# EAGLE design Edison_Mezzanine_ArduinoPro (EAGLE 7.1.0)

## Sheet 1 of 2
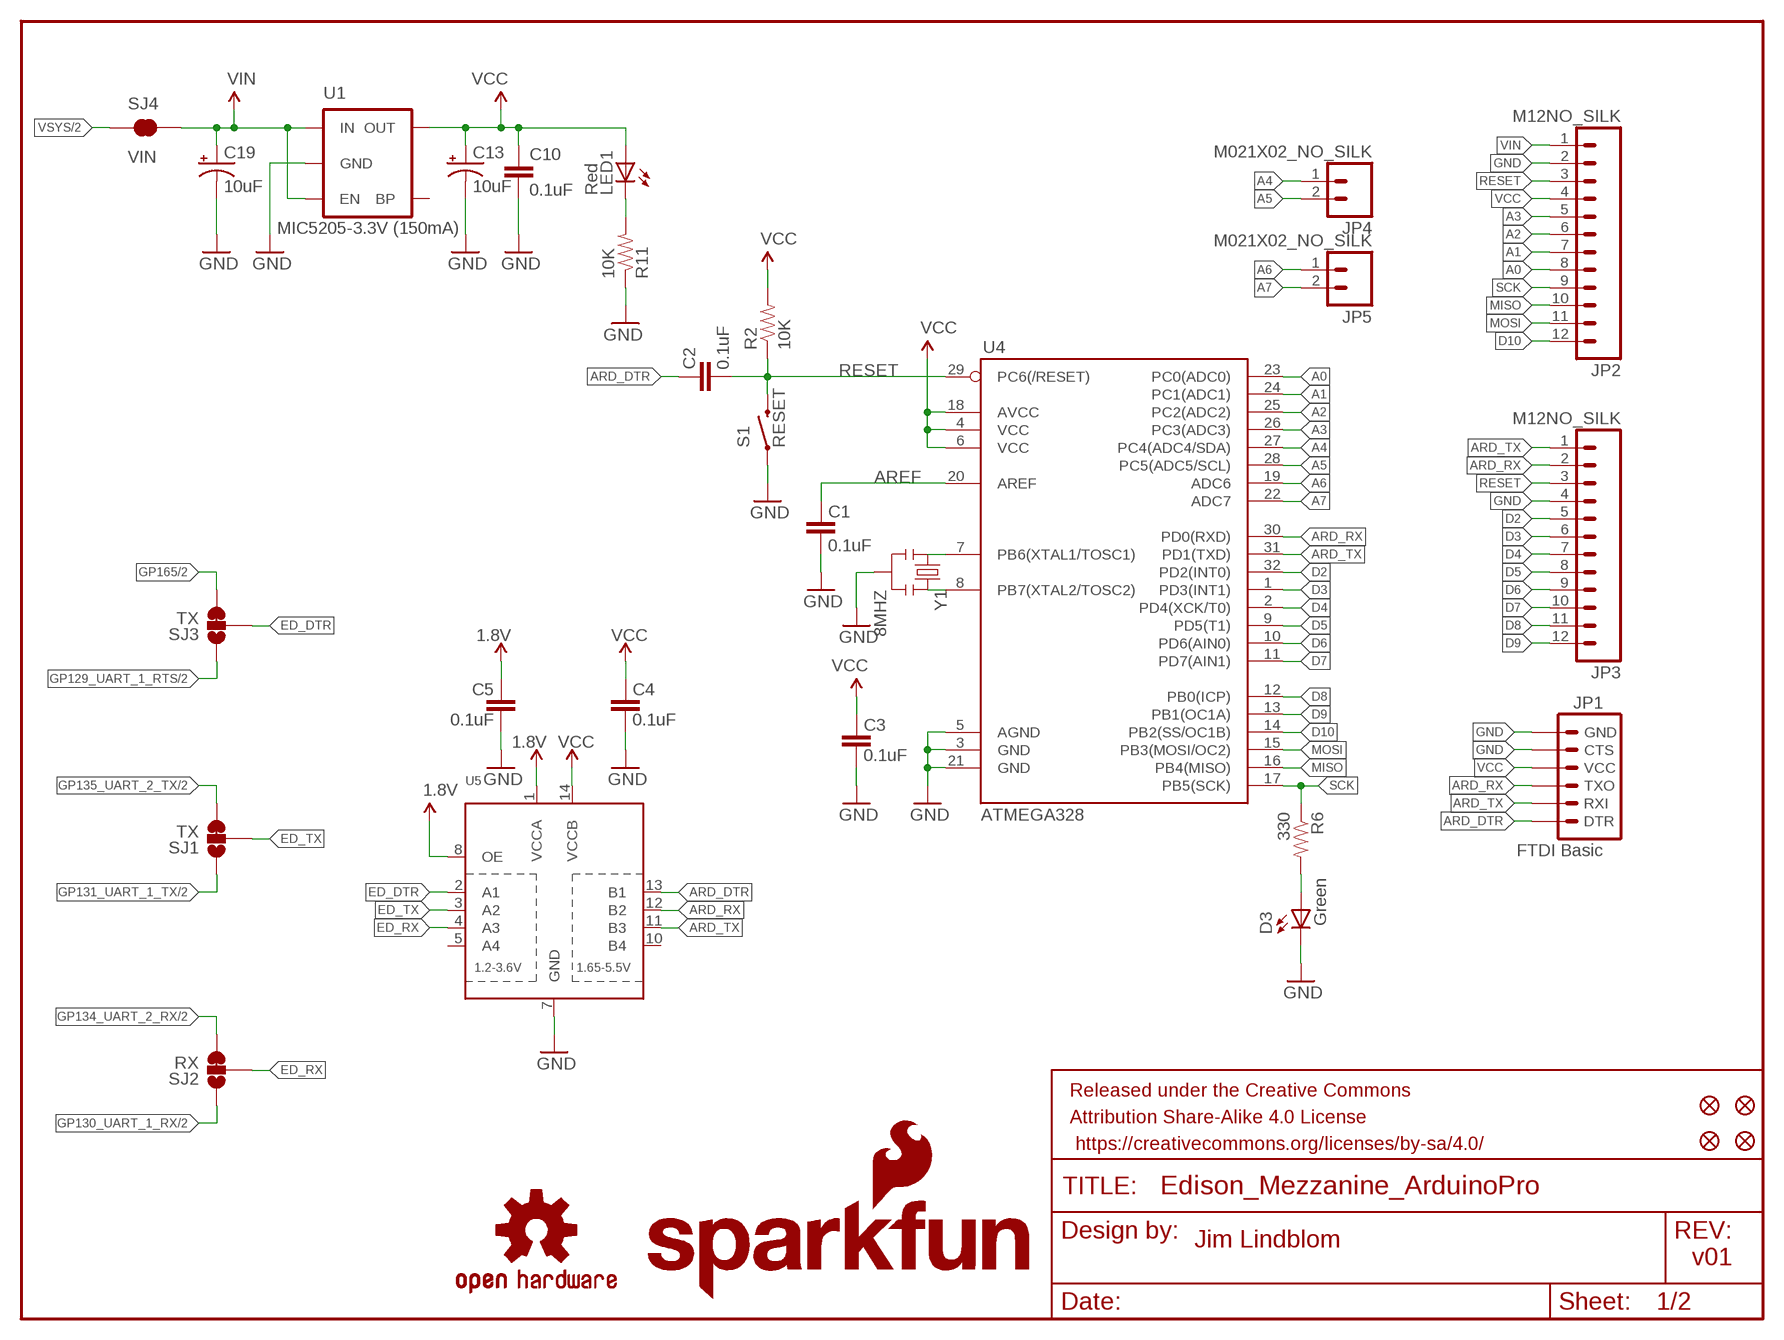
[diagram p0: schematic, sheet 1]

### Parts
C1  0.1uF  CAP0603-CAP  [0603-CAP]
C2  0.1uF  CAP0603-CAP  [0603-CAP]
C3  0.1uF  CAP0603-CAP  [0603-CAP]
C4  0.1uF  CAP0603-CAP  [0603-CAP]
C5  0.1uF  CAP0603-CAP  [0603-CAP]
C10  0.1uF  CAP0603-CAP  [0603-CAP]
C13  10uF  CAP_POL1206  [EIA3216]
C19  10uF  CAP_POL1206  [EIA3216]
D3  Green  LED  [0603-LED-ALT1]
FID1  FIDUCIAL1X2  [FIDUCIAL-1X2]
FID2  FIDUCIAL1X2  [FIDUCIAL-1X2]
FID3  FIDUCIAL1X2  [FIDUCIAL-1X2]
FID4  FIDUCIAL1X2  [FIDUCIAL-1X2]
FRAME1  FRAME-LETTER  [CREATIVE_COMMONS]
JP1  FTDI Basic  ARDUINO_SERIAL_PROGRAMPTH  [1X06]
JP2  M12NO_SILK  [1X12_NO_SILK]
JP3  M12NO_SILK  [1X12_NO_SILK]
JP4  M021X02_NO_SILK  [1X02_NO_SILK]
JP5  M021X02_NO_SILK  [1X02_NO_SILK]
LED1  Red  LED  [0603-LED-ALT1]
LOGO1  OSHW-LOGOS  [OSHW-LOGO-S]
LOGO4  SFE_LOGO_NAME_FLAME.1_INCH  [SFE_LOGO_NAME_FLAME_.1]
R2  10K  RESISTOR0603-RES  [0603-RES]
R6  330  RESISTOR0603-RES  [0603-RES]
R11  10K  RESISTOR0603-RES  [0603-RES]
S1  RESET  SWITCH-MOMENTARY-2-SMD-1101NE  [TACTILE-SWITCH-1101NE]
SJ1  TX  JUMPER-PAD-3-2OF3_NC_BY_TRACE  [PAD-JUMPER-3-2OF3_NC_BY_TRACE_YES_SILK_FULL_BOX]
SJ2  RX  JUMPER-PAD-3-2OF3_NC_BY_TRACE  [PAD-JUMPER-3-2OF3_NC_BY_TRACE_YES_SILK_FULL_BOX]
SJ3  TX  JUMPER-PAD-3-2OF3_NC_BY_TRACE  [PAD-JUMPER-3-2OF3_NC_BY_TRACE_YES_SILK_FULL_BOX]
SJ4  VIN  JUMPER-PAD-2-NC_BY_TRACE  [PAD-JUMPER-2-NC_BY_TRACE_YES_SILK]
U1  MIC5205-3.3V (150mA)  V_REG_LDOSMD  [SOT23-5]
U4  ATMEGA328  ATMEGA168  [TQFP32-08]
U5  TXB0104PWRSOIC14  [SO14]
Y1  8MHZ  RESONATOR8MHZ  [RESONATOR-SMD]

### Nets
1.8V: C5.2 U5.1(VCCA) U5.8(OE) ; also sheet 2
A0: JP2.8 U4.23(PC0(ADC0))
A1: JP2.7 U4.24(PC1(ADC1))
A2: JP2.6 U4.25(PC2(ADC2))
A3: JP2.5 U4.26(PC3(ADC3))
A4: JP4.1 U4.27(PC4(ADC4/SDA))
A5: JP4.2 U4.28(PC5(ADC5/SCL))
A6: JP5.1 U4.19(ADC6)
A7: JP5.2 U4.22(ADC7)
ARD_DTR: C2.2 JP1.1(DTR) U5.13(B1)
ARD_RX: JP1.3(TXO) JP3.2 U4.30(PD0(RXD)) U5.12(B2)
ARD_TX: JP1.2(RXI) JP3.1 U4.31(PD1(TXD)) U5.11(B3)
AREF: C1.2 U4.20(AREF)
D2: JP3.5 U4.32(PD2(INT0))
D3: JP3.6 U4.1(PD3(INT1))
D4: JP3.7 U4.2(PD4(XCK/T0))
D5: JP3.8 U4.9(PD5(T1))
D6: JP3.9 U4.10(PD6(AIN0))
D7: JP3.10 U4.11(PD7(AIN1))
D8: JP3.11 U4.12(PB0(ICP))
D9: JP3.12 U4.13(PB1(OC1A))
D10: JP2.12 U4.14(PB2(SS/OC1B))
ED_DTR: SJ3.2 U5.2(A1)
ED_RX: SJ2.2 U5.4(A3)
ED_TX: SJ1.2 U5.3(A2)
GND: C1.1 C3.1 C4.1 C5.1 C10.2 C13.C(-) C19.C(-) D3.C JP1.5(CTS) JP1.6(GND) JP2.2 JP3.4 R11.1 S1.P$1 U1.2(GND) U4.3(GND) U4.5(AGND) U4.21(GND) U5.7(GND) Y1.2 ; also sheet 2
GP129_UART_1_RTS: SJ3.1 ; also sheet 2
GP130_UART_1_RX: SJ2.1 ; also sheet 2
GP131_UART_1_TX: SJ1.1 ; also sheet 2
GP134_UART_2_RX: SJ2.3 ; also sheet 2
GP135_UART_2_TX: SJ1.3 ; also sheet 2
GP165: SJ3.3 ; also sheet 2
MISO: JP2.10 U4.16(PB4(MISO))
MOSI: JP2.11 U4.15(PB3(MOSI/OC2))
N$1: U4.8(PB7(XTAL2/TOSC2)) Y1.3
N$2: U4.7(PB6(XTAL1/TOSC1)) Y1.1
N$4: LED1.C R11.2
N$7: D3.A R6.2
RESET: C2.1 JP2.3 JP3.3 R2.1 S1.P$2 U4.29(PC6(/RESET))
SCK: JP2.9 R6.1 U4.17(PB5(SCK))
VCC: C3.2 C4.2 C10.1 C13.A(+) JP1.4(VCC) JP2.4 LED1.A R2.2 U1.5(OUT) U4.4(VCC) U4.6(VCC) U4.18(AVCC) U5.14(VCCB)
VIN: C19.A(+) JP2.1 SJ4.2 U1.1(IN) U1.3(EN)
VSYS: SJ4.1 ; also sheet 2
Unconnected: U1.4(BP) U5.5(A4) U5.10(B4)

### Notes on the sheet
- Jim Lindblom
- v01

## Sheet 2 of 2
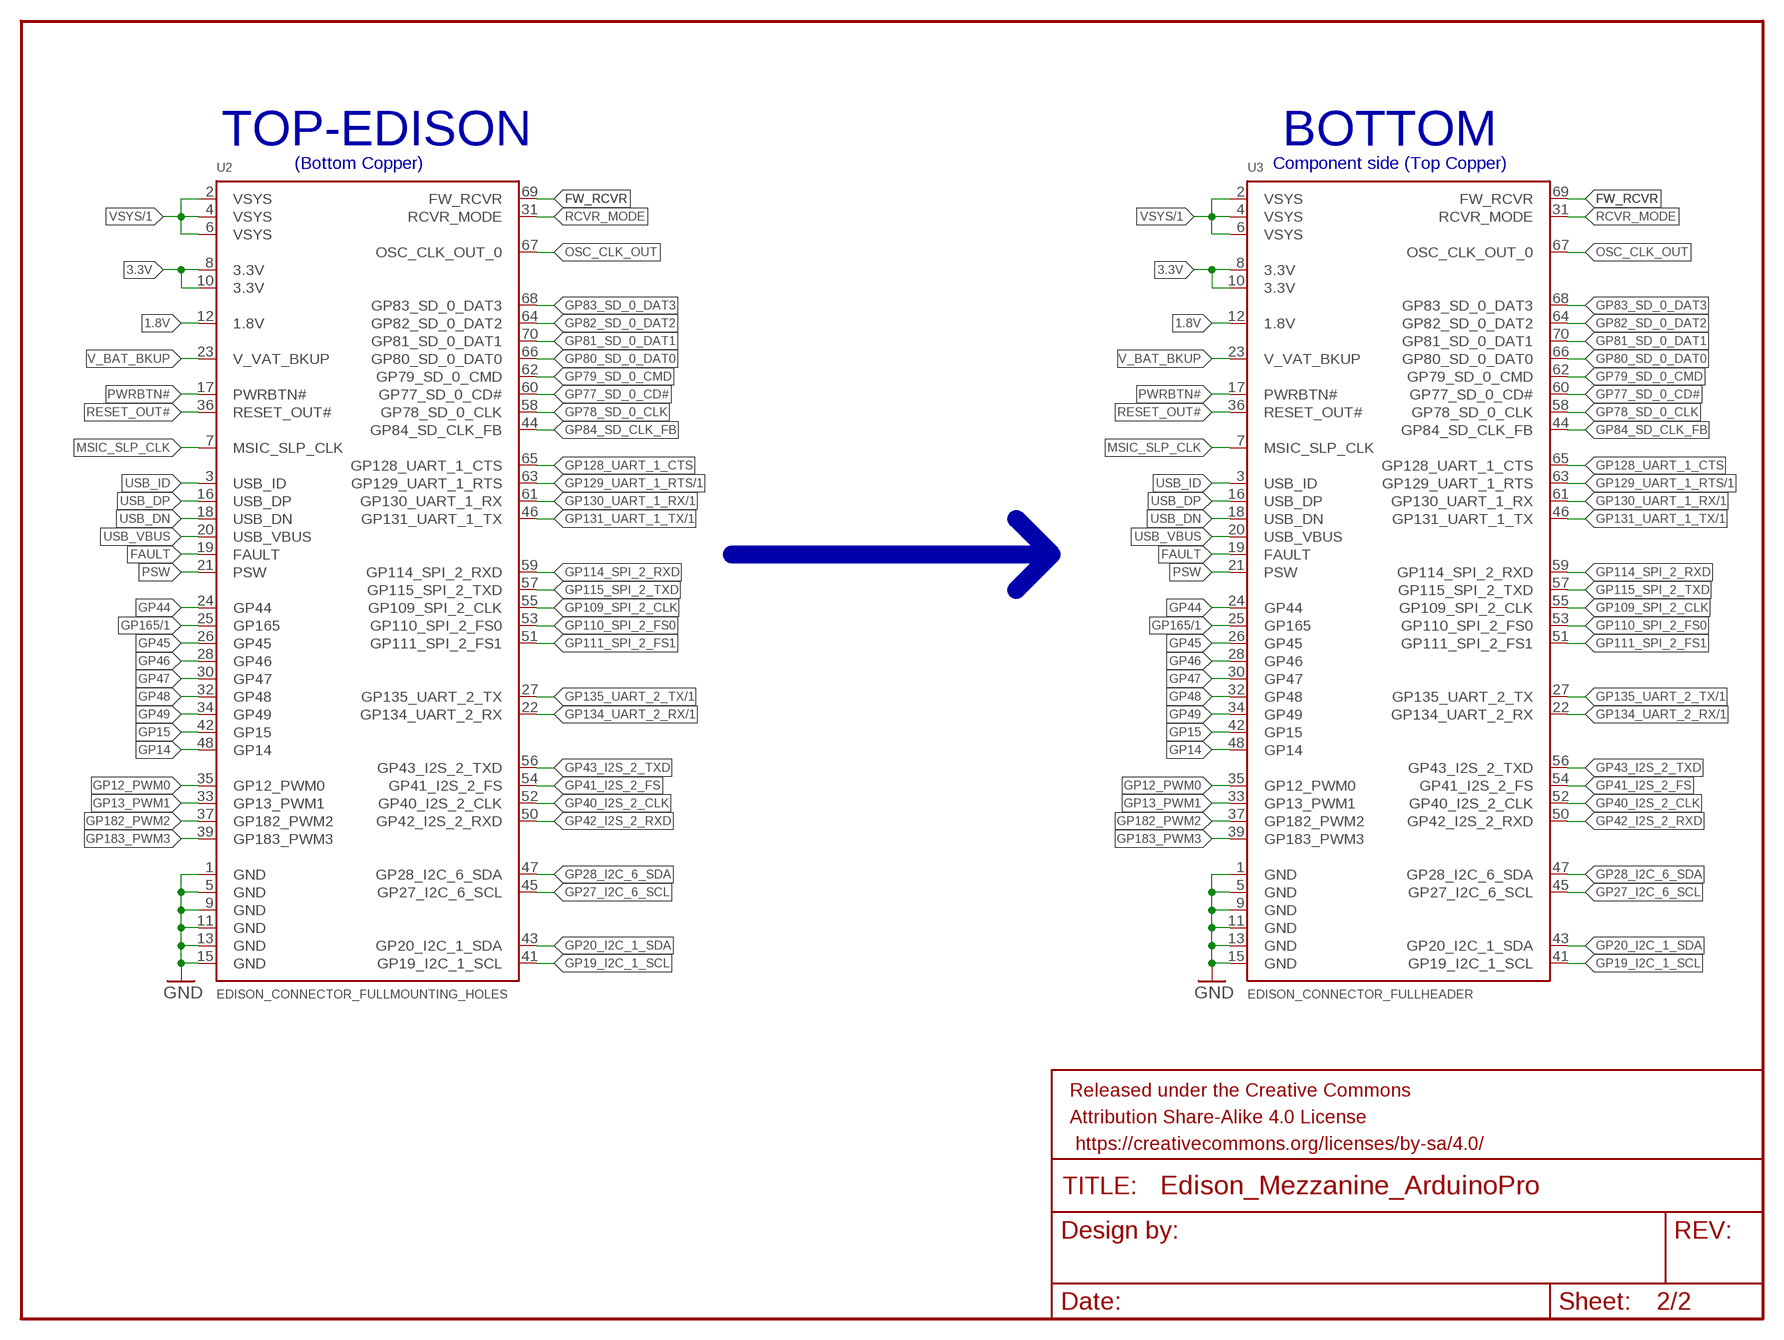
[diagram p1: schematic, sheet 2]

### Parts
FRAME2  FRAME-LETTER  [CREATIVE_COMMONS]
U2  EDISON_CONNECTOR_FULLMOUNTING_HOLES  [EDISON_DAUGHTER]
U3  EDISON_CONNECTOR_FULLHEADER  [DF40C-70DP-0.4(51)]

### Nets
1.8V: U2.12(1.8V) U3.12(1.8V) ; also sheet 1
3.3V: U2.8(3.3V) U2.10(3.3V) U3.8(3.3V) U3.10(3.3V)
FAULT: U2.19(FAULT) U3.19(FAULT)
FW_RCVR: U2.69(FW_RCVR) U3.69(FW_RCVR)
GND: U2.1(GND) U2.5(GND) U2.9(GND) U2.11(GND) U2.13(GND) U2.15(GND) U3.1(GND) U3.5(GND) U3.9(GND) U3.11(GND) U3.13(GND) U3.15(GND) ; also sheet 1
GP12_PWM0: U2.35(GP12_PWM0) U3.35(GP12_PWM0)
GP13_PWM1: U2.33(GP13_PWM1) U3.33(GP13_PWM1)
GP14: U2.48(GP14) U3.48(GP14)
GP15: U2.42(GP15) U3.42(GP15)
GP19_I2C_1_SCL: U2.41(GP19_I2C_1_SCL) U3.41(GP19_I2C_1_SCL)
GP20_I2C_1_SDA: U2.43(GP20_I2C_1_SDA) U3.43(GP20_I2C_1_SDA)
GP27_I2C_6_SCL: U2.45(GP27_I2C_6_SCL) U3.45(GP27_I2C_6_SCL)
GP28_I2C_6_SDA: U2.47(GP28_I2C_6_SDA) U3.47(GP28_I2C_6_SDA)
GP40_I2S_2_CLK: U2.52(GP40_I2S_2_CLK) U3.52(GP40_I2S_2_CLK)
GP41_I2S_2_FS: U2.54(GP41_I2S_2_FS) U3.54(GP41_I2S_2_FS)
GP42_I2S_2_RXD: U2.50(GP42_I2S_2_RXD) U3.50(GP42_I2S_2_RXD)
GP43_I2S_2_TXD: U2.56(GP43_I2S_2_TXD) U3.56(GP43_I2S_2_TXD)
GP44: U2.24(GP44) U3.24(GP44)
GP45: U2.26(GP45) U3.26(GP45)
GP46: U2.28(GP46) U3.28(GP46)
GP47: U2.30(GP47) U3.30(GP47)
GP48: U2.32(GP48) U3.32(GP48)
GP49: U2.34(GP49) U3.34(GP49)
GP77_SD_0_CD#: U2.60(GP77_SD_0_CD#) U3.60(GP77_SD_0_CD#)
GP78_SD_0_CLK: U2.58(GP78_SD_0_CLK) U3.58(GP78_SD_0_CLK)
GP79_SD_0_CMD: U2.62(GP79_SD_0_CMD) U3.62(GP79_SD_0_CMD)
GP80_SD_0_DAT0: U2.66(GP80_SD_0_DAT0) U3.66(GP80_SD_0_DAT0)
GP81_SD_0_DAT1: U2.70(GP81_SD_0_DAT1) U3.70(GP81_SD_0_DAT1)
GP82_SD_0_DAT2: U2.64(GP82_SD_0_DAT2) U3.64(GP82_SD_0_DAT2)
GP83_SD_0_DAT3: U2.68(GP83_SD_0_DAT3) U3.68(GP83_SD_0_DAT3)
GP84_SD_CLK_FB: U2.44(GP84_SD_CLK_FB) U3.44(GP84_SD_CLK_FB)
GP109_SPI_2_CLK: U2.55(GP109_SPI_2_CLK) U3.55(GP109_SPI_2_CLK)
GP110_SPI_2_FS0: U2.53(GP110_SPI_2_FS0) U3.53(GP110_SPI_2_FS0)
GP111_SPI_2_FS1: U2.51(GP111_SPI_2_FS1) U3.51(GP111_SPI_2_FS1)
GP114_SPI_2_RXD: U2.59(GP114_SPI_2_RXD) U3.59(GP114_SPI_2_RXD)
GP115_SPI_2_TXD: U2.57(GP115_SPI_2_TXD) U3.57(GP115_SPI_2_TXD)
GP128_UART_1_CTS: U2.65(GP128_UART_1_CTS) U3.65(GP128_UART_1_CTS)
GP129_UART_1_RTS: U2.63(GP129_UART_1_RTS) U3.63(GP129_UART_1_RTS) ; also sheet 1
GP130_UART_1_RX: U2.61(GP130_UART_1_RX) U3.61(GP130_UART_1_RX) ; also sheet 1
GP131_UART_1_TX: U2.46(GP131_UART_1_TX) U3.46(GP131_UART_1_TX) ; also sheet 1
GP134_UART_2_RX: U2.22(GP134_UART_2_RX) U3.22(GP134_UART_2_RX) ; also sheet 1
GP135_UART_2_TX: U2.27(GP135_UART_2_TX) U3.27(GP135_UART_2_TX) ; also sheet 1
GP165: U2.25(GP165) U3.25(GP165) ; also sheet 1
GP182_PWM2: U2.37(GP182_PWM2) U3.37(GP182_PWM2)
GP183_PWM3: U2.39(GP183_PWM3) U3.39(GP183_PWM3)
MSIC_SLP_CLK: U2.7(MSIC_SLP_CLK) U3.7(MSIC_SLP_CLK)
OSC_CLK_OUT: U2.67(OSC_CLK_OUT_0) U3.67(OSC_CLK_OUT_0)
PSW: U2.21(PSW) U3.21(PSW)
PWRBTN#: U2.17(PWRBTN#) U3.17(PWRBTN#)
RCVR_MODE: U2.31(RCVR_MODE) U3.31(RCVR_MODE)
RESET_OUT#: U2.36(RESET_OUT#) U3.36(RESET_OUT#)
USB_DN: U2.18(USB_DN) U3.18(USB_DN)
USB_DP: U2.16(USB_DP) U3.16(USB_DP)
USB_ID: U2.3(USB_ID) U3.3(USB_ID)
USB_VBUS: U2.20(USB_VBUS) U3.20(USB_VBUS)
V_BAT_BKUP: U2.23(V_VAT_BKUP) U3.23(V_VAT_BKUP)
VSYS: U2.2(VSYS) U2.4(VSYS) U2.6(VSYS) U3.2(VSYS) U3.4(VSYS) U3.6(VSYS) ; also sheet 1

### Buses
B$1

### Notes on the sheet
- TOP-EDISON | BOTTOM
- (Bottom Copper) | Component side (Top Copper)

## Library data of the parts
C1-C5 C10 = SparkFun:CAP: Capacitor Standard 0603 ceramic capacitor, and 0.1" leaded capacitor.
C13 C19 = SparkFun:CAP_POL: Capacitor Polarized These are standard SMD and PTH capacitors. Normally 10uF, 47uF, and 100uF in electrolytic and tantalum varieties. Always verify the external diameter of the through hole cap, it varies with capacity, voltage, and manufacturer. The EIA devices should be standard.
D3 LED1 = Testing:LED: LEDs Standard schematic elements and footprints for 5mm, 3mm, 1206, and 0603 sized LEDs. 5mm - Spark Fun Electronics SKU : COM-00529 (and others)
FID1-FID4 = SparkFun-Aesthetics:FIDUCIAL: Fiducial Alignment Points Various fiducial points for machine vision alignment.
FRAME1 FRAME2 = SparkFun-Aesthetics:FRAME-LETTER: Schematic Frame Standard 8.5x11 US Letter frame
JP1 = SparkFun:ARDUINO_SERIAL_PROGRAM
JP2 JP3 = SparkFun-Connectors:M12: Header 12 Standard 12-pin 0.1" header. Use with straight break away headers (SKU : PRT-00116), right angle break away headers (PRT-00553), swiss pins (PRT-00743), machine pins (PRT-00117), and female headers (PRT-00115).
JP4 JP5 = SparkFun-Connectors:M02: Standard 2-pin 0.1" header. Use with - straight break away headers ( PRT-00116) - right angle break away headers (PRT-00553) - swiss pins (PRT-00743) - machine pins (PRT-00117) - female headers (PRT-00115) Molex polarized connector foot print use with: PRT-08233 with associated crimp pins and housings. 2.54_SCREWTERM for use with PRT-10571. 3.5mm Screw Terminal footprints for PRT-08084 5mm Screw Terminal footprints for use with PRT-08432
LOGO1 = SparkFun-Aesthetics:OSHW-LOGO: Open Source Hardware Logo This logo indicates the piece of hardware it is found on incorporates a OSHW license and/or adheres to the definition of open source hardware found here: http://freedomdefined.org/OSHW
LOGO4 = SparkFun-Aesthetics:SFE_LOGO_NAME_FLAME: SFE Logo, name and flame This is the SparkFun full logo. The logo on the schematic will always be the same size; the package variant is the height of the flame part of the logo. Default layer for the logo on the board is tSilk.
R2 R6 R11 = SparkFun:RESISTOR: Resistor Basic schematic elements and footprints for 0603, 1206, and PTH resistors.
S1 = SparkFun-Electromechanical:SWITCH-MOMENTARY-2: Various NO switches- pushbuttons, reed, etc
SJ1-SJ3 = SparkFun-Passives:JUMPER-PAD-3-2OF3_NC_BY_TRACE
SJ4 = SparkFun-Passives:JUMPER-PAD-2-NC_BY_TRACE
U1 = SparkFun:V_REG_LDO: Voltage Regulator LDO Standard 150mA LDO voltage regulator in SOT-23 layout. Micrel part MIC5205. BP (by-pass) pin is used to lower output noise with 470pF cap.
U2 U3 = Edison:EDISON_CONNECTOR_FULL
U4 = SparkFun:ATMEGA168
U5 = SparkFun-DigitalIC:TXB0104PWR: 4-Bit Bi-Directional Level Shifter 1.2V-3.6V (VCCA) to 1.65V-5.5V (VCCB) bi-directional level shifter with auto direction sensing. Max data rate - VCCA 1.8V: 20Mbps (50ns), VCCA 3.3V: 100Mbps (10ns) Digikey: 296-21929-1-ND (TSSOP) IC-11329; PROD_ID: IC-11329
Y1 = SparkFun-FreqCtrl:RESONATOR: Resonator Small SMD resonator. Used, eg, on the Arduino Pro/ Pro Mini boards. 8MHz- XTAL-08895 16MHz- XTAL-08900; PROD_ID: XTAL-08895

## Net classes
1 vcc: width 0.254 mm

## Board
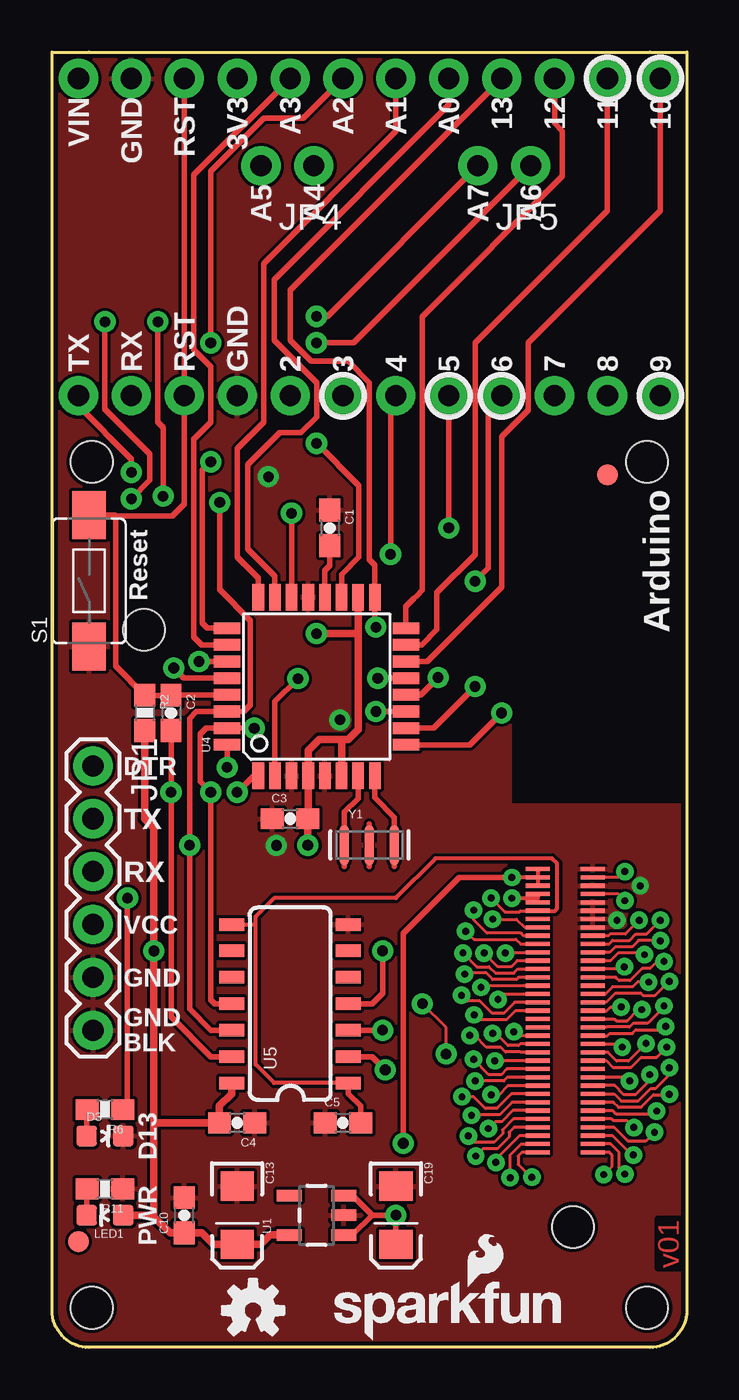
[diagram p2: board, top side]
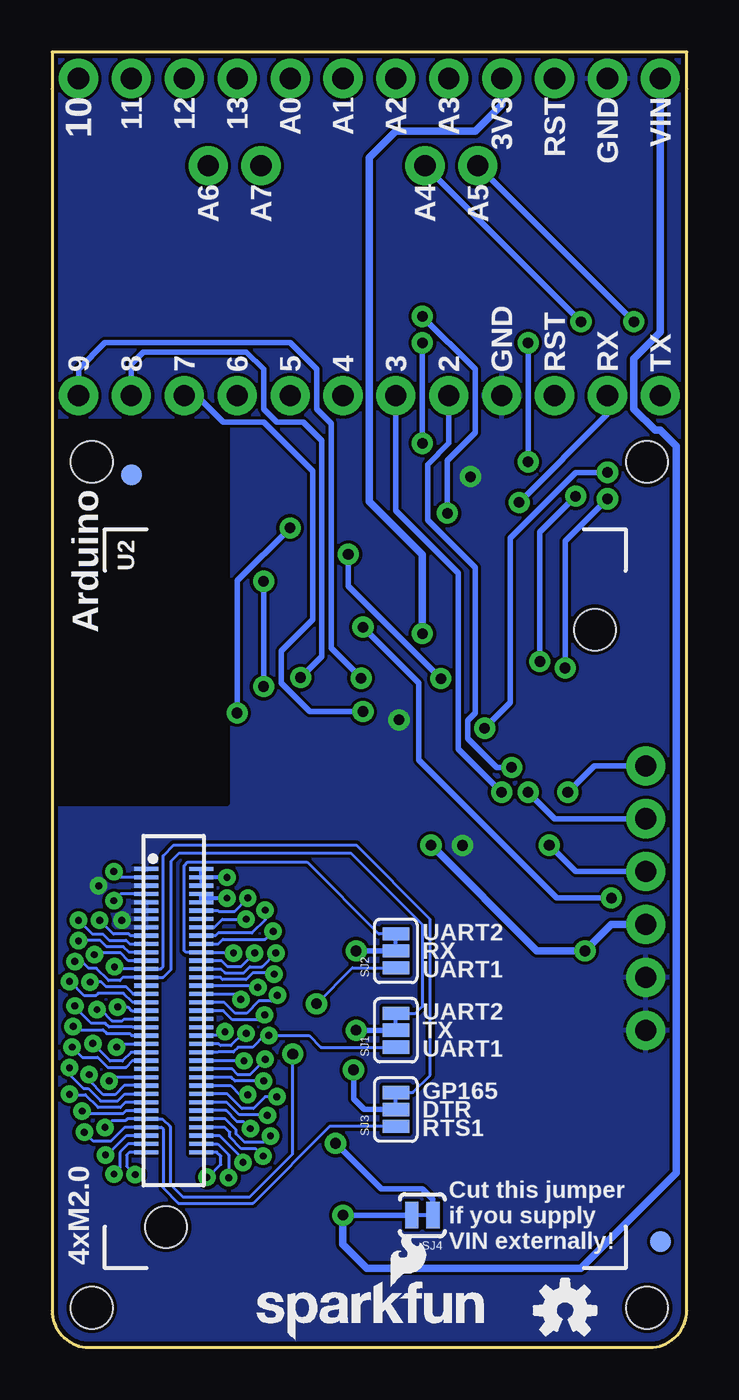
[diagram p3: board, bottom side, seen from below]

Size 30.48 x 62.23 mm. Coordinates in mm from the lower left corner, seen from the top.
Outline: 30.48,60.45 30.48,1.78 arc-90 28.7,0 1.78,0 arc-90 0,1.78 0,60.45 0,62.23 1.78,62.23 28.7,62.23 30.48,62.23 30.48,60.45
Copper layers (1*16): Top 0.035mm / dielectric 1.5mm / Bottom 0.035mm
Design rules "SparkFun-2-layer *": minimum track width 6mil, minimum drill 13mil, track to track 6mil, track to pad 6mil, pad to pad 6mil, via to via 6mil, smd to smd 6mil, copper to edge 8mil, drill to drill 8mil, minimum pad ring 12mil, minimum via ring 10mil, stop-mask expansion 4mil, vias tented up to drill 20mil, thermal gap 6mil
Holes 2 mm at 28.57,1.91 1.91,1.91 1.91,42.55 28.57,42.55
tRestrict: area 22.1,26.2 to 30.5,44.5
bRestrict: area 22.1,26.2 to 30.5,44.5

### Footprints (pad centres in the part's own frame; a part is rotated, then mirrored left to right if it is on the bottom)
0603-CAP = smd 1.1 x 1: 1 -0.85,0; 2 0.85,0
EIA3216 = smd 1.4 x 1.6: A 1.4,0; C -1.4,0
0603-LED-ALT1 = smd 1 x 1: A 0,-0.877; C 0,0.877
FIDUCIAL-1X2 = smd 1 x 1: 1 0,0
1X06 = drill 1.016 pad 1.88: 1 0,0; 2 2.54,0; 3 5.08,0; 4 7.62,0; 5 10.16,0; 6 12.7,0
1X12_NO_SILK = drill 1.016 pad 1.88: 1 0,0; 2 2.54,0; 3 5.08,0; 4 7.62,0; 5 10.16,0; 6 12.7,0; 7 15.24,0; 8 17.78,0; 9 20.32,0; 10 22.86,0; 11 25.4,0; 12 27.94,0
1X02_NO_SILK = drill 1.016 pad 1.88: 1 0,0; 2 2.54,0
0603-RES = smd 1.1 x 1: 1 -0.85,0; 2 0.85,0
TACTILE-SWITCH-1101NE = smd 2.3 x 1.6: P$1 -3.15,0; P$2 3.15,0
PAD-JUMPER-3-2OF3_NC_BY_TRACE_YES_SILK_FULL_BOX = smd 0.635 x 1.27: 1 -0.813,0; 2 0,0; 3 0.813,0
PAD-JUMPER-2-NC_BY_TRACE_YES_SILK = smd 0.635 x 1.27: 1 -0.508,0; 2 0.508,0
SOT23-5 = smd 0.55 x 1.2: 1 -0.95,-1.3; 2 0,-1.3; 3 0.95,-1.3; 4 0.95,1.3; 5 -0.95,1.3
EDISON_DAUGHTER = smd 1.14 x 0.2: 1 1.98,19.17; 2 4.62,19.17; 3 1.98,18.77; 4 4.62,18.77; 5 1.98,18.37; 6 4.62,18.37; 7 1.98,17.97; 8 4.62,17.97; 9 1.98,17.57; 10 4.62,17.57; 11 1.98,17.17; 12 4.62,17.17; 13 1.98,16.77; 14 4.62,16.77; 15 1.98,16.37; 16 4.62,16.37; 17 1.98,15.97; 18 4.62,15.97; 19 1.98,15.57; 20 4.62,15.57; 21 1.98,15.17; 22 4.62,15.17; 23 1.98,14.77; 24 4.62,14.77; 25 1.98,14.37; 26 4.62,14.37; 27 1.98,13.97; 28 4.62,13.97; 29 1.98,13.57; 30 4.62,13.57; 31 1.98,13.17; 32 4.62,13.17; 33 1.98,12.77; 34 4.62,12.77; 35 1.98,12.37; 36 4.62,12.37; 37 1.98,11.97; 38 4.62,11.97; 39 1.98,11.57; 40 4.62,11.57; 41 1.98,11.17; 42 4.62,11.17; 43 1.98,10.77; 44 4.62,10.77; 45 1.98,10.37; 46 4.62,10.37; 47 1.98,9.97; 48 4.62,9.97; 49 1.98,9.57; 50 4.62,9.57; 51 1.98,9.17; 52 4.62,9.17; 53 1.98,8.77; 54 4.62,8.77; 55 1.98,8.37; 56 4.62,8.37; 57 1.98,7.97; 58 4.62,7.97; 59 1.98,7.57; 60 4.62,7.57; 61 1.98,7.17; 62 4.62,7.17; 63 1.98,6.77; 64 4.62,6.77; 65 1.98,6.37; 66 4.62,6.37; 67 1.98,5.97; 68 4.62,5.97; 69 1.98,5.57; 70 4.62,5.57 | hole 2: 23.53,30.67; 2.93,1.98
DF40C-70DP-0.4(51) = smd 0.2 x 1.14 bottom: 1 6.8,1.32; 2 6.8,-1.32; 3 6.4,1.32; 4 6.4,-1.32; 5 6,1.32; 6 6,-1.32; 7 5.6,1.32; 8 5.6,-1.32; 9 5.2,1.32; 10 5.2,-1.32; 11 4.8,1.32; 12 4.8,-1.32; 13 4.4,1.32; 14 4.4,-1.32; 15 4,1.32; 16 4,-1.32; 17 3.6,1.32; 18 3.6,-1.32; 19 3.2,1.32; 20 3.2,-1.32; 21 2.8,1.32; 22 2.8,-1.32; 23 2.4,1.32; 24 2.4,-1.32; 25 2,1.32; 26 2,-1.32; 27 1.6,1.32; 28 1.6,-1.32; 29 1.2,1.32; 30 1.2,-1.32; 31 0.8,1.32; 32 0.8,-1.32; 33 0.4,1.32; 34 0.4,-1.32; 35 0,1.32; 36 0,-1.32; 37 -0.4,1.32; 38 -0.4,-1.32; 39 -0.8,1.32; 40 -0.8,-1.32; 41 -1.2,1.32; 42 -1.2,-1.32; 43 -1.6,1.32; 44 -1.6,-1.32; 45 -2,1.32; 46 -2,-1.32; 47 -2.4,1.32; 48 -2.4,-1.32; 49 -2.8,1.32; 50 -2.8,-1.32; 51 -3.2,1.32; 52 -3.2,-1.32; 53 -3.6,1.32; 54 -3.6,-1.32; 55 -4,1.32; 56 -4,-1.32; 57 -4.4,1.32; 58 -4.4,-1.32; 59 -4.8,1.32; 60 -4.8,-1.32; 61 -5.2,1.32; 62 -5.2,-1.32; 63 -5.6,1.32; 64 -5.6,-1.32; 65 -6,1.32; 66 -6,-1.32; 67 -6.4,1.32; 68 -6.4,-1.32; 69 -6.8,1.32; 70 -6.8,-1.32
TQFP32-08 = smd 1.27 x 0.559: 1 -4.293,2.8; 2 -4.293,2; 3 -4.293,1.2; 4 -4.293,0.4; 5 -4.293,-0.4; 6 -4.293,-1.2; 7 -4.293,-2; 8 -4.293,-2.8; 17 4.293,-2.8; 18 4.293,-2; 19 4.293,-1.2; 20 4.293,-0.4; 21 4.293,0.4; 22 4.293,1.2; 23 4.293,2; 24 4.293,2.8 | smd 0.559 x 1.27: 9 -2.8,-4.293; 10 -2,-4.293; 11 -1.2,-4.293; 12 -0.4,-4.293; 13 0.4,-4.293; 14 1.2,-4.293; 15 2,-4.293; 16 2.8,-4.293; 25 2.8,4.293; 26 2,4.293; 27 1.2,4.293; 28 0.4,4.293; 29 -0.4,4.293; 30 -1.2,4.293; 31 -2,4.293; 32 -2.8,4.293
SO14 = smd 0.6 x 1.2: 1 -3.81,-2.8; 2 -2.54,-2.8; 3 -1.27,-2.8; 4 0,-2.8; 5 1.27,-2.8; 6 2.54,-2.8; 7 3.81,-2.8; 8 3.81,2.8; 9 2.54,2.8; 10 1.27,2.8; 11 0,2.8; 12 -1.27,2.8; 13 -2.54,2.8; 14 -3.81,2.8
RESONATOR-SMD = smd 0.45 x 1.905: 1 -1.2,0; 2 0,0; 3 1.2,0

### Placement (x,y rotation side)
C1  13.34,39.37 270 top
C2  5.71,30.48 270 top
C3  11.43,25.4 0 top
C4  8.89,10.79 180 top
C5  13.97,10.79 0 top
C10  6.35,6.35 90 top
C13  8.89,6.35 270 top
C19  16.51,6.35 270 top
D3  2.54,10.16 270 top
FID1  1.27,5.08 0 top
FID2  26.67,41.91 0 top
FID3  1.27,5.08 0 bottom
FID4  26.67,41.91 0 bottom
FRAME1  -1.27,-13.97 0 top  (outside the outline)
FRAME2  -1.27,-13.97 0 top  (outside the outline)
JP1  1.97,27.94 270 top
JP2  1.27,60.96 0 top
JP3  1.27,45.72 0 top
JP4  12.57,56.77 180 top
JP5  22.99,56.77 180 top
LED1  2.54,6.35 90 top
LOGO1  9.65,1.78 0 top
LOGO2  OSHW-LOGOS  [OSHW-LOGO-S]  5.84,1.78 0 bottom
LOGO3  SFE_LOGO_NAME_FLAME.1_INCH  [SFE_LOGO_NAME_FLAME_.1]  21.08,0.25 0 bottom
LOGO4  13.11,0.25 0 top
R2  4.45,30.48 270 top
R6  2.54,11.43 180 top
R11  2.54,7.62 180 top
S1  1.78,36.83 90 top
SJ1  13.97,15.24 90 bottom
SJ2  13.97,19.05 90 bottom
SJ3  13.97,11.43 90 bottom
SJ4  12.7,6.35 180 bottom
U1  12.7,6.35 90 top
U2  27.94,3.81 0 bottom
U3  24.64,16.18 90 bottom
U4  12.7,31.75 90 top
U5  11.43,16.51 90 top
Y1  15.24,24.13 0 top

### Tracks (layer width: path | path; a pad name or v marks a point on that pad's centre or on a via)
1.8V  (via drill 0.33)
  Top 0.152: v21.08,21.59 21.74,20.93 22.45,20.93 22.5,20.98 U3.12 | 8.89,20.32 U5.8
  Top 0.203: U3.12 24.16,20.98 24.26,21.08 24.26,23.24 24,23.5 18.41,23.5 16.51,21.59 10.67,21.59 9.78,20.7 9.78,20.32 | 8.89,20.32 9.78,20.32 | U5.1 10.67,12.7 9.78,13.59 9.78,20.32
  Top 0.254: C5.2 14.82,11.6 14.23,12.19 U5.1
  Bottom 0.152: U3.12 22.5,20.98 22.45,20.93 21.74,20.93 v21.08,21.59
3.3V  (via drill 0.33)
  Top 0.2: v22.08,21.58 23.32,21.58 U3.8 U3.10
  Bottom 0.152: 23.32,21.58 U3.10 | U3.10 | U3.8
  Bottom 0.2: v22.08,21.58 23.32,21.58 | U3.10 U3.8
A0
  Top 0.254: JP2.8 19.05,59.69 10.67,51.31 10.67,48.39 12.7,46.35 12.7,44.7 11.94,43.94 10.92,43.94 9.4,42.42 9.4,38.35 10.7,37.05 U4.23
A1
  Top 0.254: JP2.7 16.51,58.42 10.16,52.07 10.16,44.45 8.89,43.18 8.89,37.97 9.9,36.96 U4.24
A2  (via drill 0.51)
  Top 0.254: U4.25 7.46,34.55 7.21,34.8 7.21,42.14 v7.62,42.55 | v7.62,48.26 7.62,56.52 10.16,59.05 12.06,59.05 JP2.6
  Bottom 0.254: v7.62,42.55 v7.62,48.26
A3
  Top 0.254: U4.26 7.2,33.75 6.81,34.14 6.81,43.64 7.62,44.45 7.62,47.12 6.81,47.93 6.81,56.34 JP2.5
A4  (via drill 0.51)
  Top 0.254: U4.27 v7.05,32.95 | v5.33,40.89 5.33,44.2 5.08,44.45 v5.08,49.28
  Bottom 0.254: v7.05,32.95 7.05,39.17 v5.33,40.89 | v5.08,49.28 JP4.1
A5  (via drill 0.51)
  Top 0.254: U4.28 6.33,32.15 v5.84,32.64 | v3.81,40.77 4.7,41.66 4.7,42.93 2.54,45.09 v2.54,49.28
  Bottom 0.254: v5.84,32.64 5.84,38.73 v3.81,40.77 | v2.54,49.28 JP4.2
A6  (via drill 0.51)
  Top 0.254: U4.19 13.9,37.14 14.73,37.97 14.73,41.4 v12.7,43.43 | v12.7,48.26 14.48,48.26 JP5.1
  Bottom 0.254: v12.7,43.43 v12.7,48.26
A7  (via drill 0.51)
  Top 0.254: U4.22 v11.5,40.08 | v12.7,49.53 13.21,49.53 JP5.2
  Bottom 0.254: v12.7,49.53 10.16,46.99 10.16,43.94 11.5,42.6 v11.5,40.08
ARD_DTR  (via drill 0.51)
  Top 0.254: U5.13 7.62,13.97 5.71,15.88 v5.71,26.67 C2.2
  Bottom 0.254: JP1.1 4.45,27.94 v5.71,26.67
ARD_RX  (via drill 0.51)
  Top 0.254: U5.12 7.62,15.24 6.6,16.26 v6.6,24.13 6.6,30.23 6.93,30.55 U4.30 9.21,30.55 9.53,30.86 9.53,34.92 8.05,36.4 v8.05,40.59
  Bottom 0.254: JP1.3 5.33,22.86 v6.6,24.13 | v8.05,40.59 3.81,44.83 JP3.2
ARD_TX  (via drill 0.51)
  Top 0.254: U5.11 7.81,16.51 7.62,16.7 v7.62,26.67 7.11,27.18 7.11,29.46 7.4,29.75 U4.31 v9.71,29.75 | v3.81,42.04 3.81,42.67 1.27,45.21 JP3.1
  Bottom 0.254: v9.71,29.75 8.48,30.98 8.48,38.89 5.33,42.04 v3.81,42.04 | JP1.2 6.35,25.4 v7.62,26.67
AREF
  Top 0.254: U4.20 13.1,37.32 13.34,37.55 C1.2
D2  (via drill 0.51)
  Top 0.254: v8.41,27.86 U4.32
  Bottom 0.254: v8.41,27.86 9.12,27.86 10.52,29.26 10.52,30.12 10.16,30.48 10.16,37.47 12.45,39.75 12.45,42.42 11.43,43.43 JP3.5
D3  (via drill 0.51)
  Top 0.254: U4.1 9.68,27.46 v8.89,26.67
  Bottom 0.254: v8.89,26.67 10.97,28.75 10.97,37.21 13.97,40.21 JP3.6
D4  (via drill 0.51)
  Top 0.254: U4.2 10.7,31.02 v11.81,32.13 | v16.26,38.1 16.26,45.47 JP3.7
  Bottom 0.254: v11.81,32.13 16.26,36.58 v16.26,38.1
D5  (via drill 0.51)
  Top 0.254: U4.9 20.06,28.95 v21.59,30.48 | v19.05,39.37 JP3.8
  Bottom 0.254: v21.59,30.48 21.59,36.83 v19.05,39.37
D6  (via drill 0.51)
  Top 0.254: v20.32,36.8 20.95,37.44 20.95,45.09 JP3.9 | U4.10 18.32,29.75 v20.32,31.75
  Bottom 0.254: v20.32,31.75 v20.32,36.8
D7  (via drill 0.51)
  Top 0.254: U4.11 v15.55,30.55
  Bottom 0.254: v15.55,30.55 18.1,30.55 19.48,31.93 19.48,33.45 17.97,34.96 17.97,42.1 20.32,44.45 22.25,44.45 23.52,45.72 JP3.10
D8  (via drill 0.51)
  Top 0.254: U4.12 17.71,31.35 v18.54,32.18
  Bottom 0.254: JP3.11 26.67,47.24 26.1,47.82 21.14,47.82 20.32,46.99 20.32,45.09 19.68,44.45 18.41,44.45 17.53,43.56 17.53,33.2 v18.54,32.18
D9  (via drill 0.51)
  Top 0.254: U4.13 v15.64,32.15
  Bottom 0.254: JP3.12 29.21,46.99 27.94,48.26 19.05,48.26 17.78,46.99 17.78,45.09 17.08,44.39 17.08,33.59 v15.64,32.15
D10
  Top 0.254: U4.14 18.02,32.95 21.59,36.52 21.59,43.75 22.86,45.02 22.86,48.26 29.21,54.61 JP2.12
ED_DTR  (via drill 0.51)
  Top 0.254: U5.2 15.37,13.97 v16,13.34
  Bottom 0.254: v16,13.34 16,11.94 15.49,11.43 SJ3.2
ED_RX  (via drill 0.51)
  Top 0.254: U5.4 15.37,16.51 15.88,17.02 v15.88,19.05
  Bottom 0.254: v15.88,19.05 SJ2.2
ED_TX  (via drill 0.51)
  Top 0.254: U5.3 v15.88,15.24
  Bottom 0.254: v15.88,15.24 SJ1.2
FAULT  (via drill 0.33)
  Top 0.152: U3.19 26.75,19.38 26.92,19.56 27.74,19.56 28.04,19.86 28.55,19.86 v29.21,20.52
  Bottom 0.152: v29.21,20.52 28.55,19.86 28.04,19.86 27.74,19.56 26.92,19.56 26.75,19.38 U3.19
FW_RCVR  (via drill 0.33)
  Top 0.152: v26.49,8.31 26.9,8.71 26.9,9.25 26.76,9.38 U3.69
  Bottom 0.152: U3.69 26.76,9.38 26.9,9.25 26.9,8.71 v26.49,8.31
GND  (via drill 0.33, 0.51)
  other vias: 27.13,20.52 28.24,22.17 10.77,24.12 13.82,30.15 10.39,41.83
  pour Bottom (isolate 0.152, rank 6): 30.48,62.23 30.48,1.78 arc-90 28.7,0 1.78,0 arc-90 0,1.78 0,62.23
  pour Top (rank 6): 30.48,1.73 arc-90 28.75,0 1.78,0 arc-90 0,1.78 0,60.45 0,62.23 1.78,62.23 28.7,62.23 30.48,62.23 30.48,60.45
GP12_PWM0  (via drill 0.33)
  Top 0.152: U3.35 26.64,16.18 26.82,16.36 v27.33,16.36
  Bottom 0.152: v27.33,16.36 26.82,16.36 26.64,16.18 U3.35 | U3.35
GP13_PWM1  (via drill 0.33)
  Top 0.152: v29.64,17.58 29.62,17.58 28.93,16.89 28.4,16.89 28.27,17.02 27.05,17.02 26.61,16.58 U3.33
  Bottom 0.152: U3.33 26.61,16.58 27.05,17.02 28.27,17.02 28.4,16.89 28.93,16.89 29.62,17.58 v29.64,17.58
GP14  (via drill 0.33)
  Top 0.152: v21.26,13.77 21.27,13.78 U3.48
  Bottom 0.152: U3.48 21.27,13.78 v21.26,13.77
GP15  (via drill 0.33)
  Top 0.152: U3.42 22.36,14.98 v22.17,15.16
  Bottom 0.152: v22.17,15.16 22.36,14.98 U3.42
GP19_I2C_1_SCL  (via drill 0.33)
  Top 0.152: U3.41 26.66,14.98 26.77,15.09 27.86,15.09 28.04,15.27 29.31,15.27 v29.46,15.42
  Bottom 0.152: v29.46,15.42 29.31,15.27 28.04,15.27 27.86,15.09 26.77,15.09 26.66,14.98 U3.41
GP20_I2C_1_SDA  (via drill 0.33)
  Top 0.152: U3.43 27.23,14.58 v27.38,14.43
  Bottom 0.152: v27.38,14.43 27.23,14.58 U3.43 | U3.43
GP27_I2C_6_SCL  (via drill 0.33)
  Top 0.152: v28.52,14.61 27.69,13.77 27.1,13.77 26.69,14.18 U3.45
  Bottom 0.152: U3.45 26.69,14.18 27.1,13.77 27.69,13.77 v28.52,14.61
GP28_I2C_6_SDA  (via drill 0.33)
  Top 0.152: U3.47 26.61,13.78 26.92,13.46 27.81,13.46 28.3,13.95 29.03,13.95 v29.52,14.43
  Bottom 0.152: v29.52,14.43 29.03,13.95 28.3,13.95 27.81,13.46 26.92,13.46 26.61,13.78 U3.47
GP40_I2S_2_CLK  (via drill 0.33)
  Top 0.152: U3.52 21.87,12.98 21.69,12.8 v20.32,12.8
  Bottom 0.152: v20.32,12.8 21.69,12.8 21.87,12.98 U3.52
GP41_I2S_2_FS  (via drill 0.33)
  Top 0.152: v21.08,12.14 21.46,12.14 21.9,12.58 U3.54
  Bottom 0.152: U3.54 21.9,12.58 21.46,12.14 v21.08,12.14
GP42_I2S_2_RXD  (via drill 0.33)
  Top 0.152: U3.50 21.84,13.38 21.57,13.11 20.98,13.11 v20.24,13.84
  Bottom 0.152: v20.24,13.84 20.98,13.11 21.57,13.11 21.84,13.38 U3.50
GP43_I2S_2_TXD  (via drill 0.33)
  Top 0.152: U3.56 22.06,12.18 21.36,11.48 20.8,11.48 20.24,12.04 v19.68,12.04
  Bottom 0.152: v19.68,12.04 20.24,12.04 20.8,11.48 21.36,11.48 22.06,12.18 U3.56
GP44  (via drill 0.33)
  Top 0.152: U3.24 22.34,18.58 22.05,18.29 21.41,18.29 v20.75,18.95
  Bottom 0.152: v20.75,18.95 21.41,18.29 22.05,18.29 22.34,18.58 U3.24
GP45  (via drill 0.33)
  Top 0.152: v19.74,18.95 20.4,18.29 20.98,18.29 21.29,17.98 22.17,17.98 22.37,18.18 U3.26
  Bottom 0.152: U3.26 22.37,18.18 22.17,17.98 21.29,17.98 20.98,18.29 20.4,18.29 v19.74,18.95
GP46  (via drill 0.33)
  Top 0.152: U3.28 22.4,17.78 22.3,17.68 21.16,17.68 20.85,17.98 19.86,17.98 v19.81,17.93
  Bottom 0.152: v19.81,17.93 19.86,17.98 20.85,17.98 21.16,17.68 22.3,17.68 22.4,17.78 U3.28
GP47  (via drill 0.33)
  Top 0.152: U3.30 22.43,17.38 22.43,17.37 20.68,17.37 v20.6,17.3
  Bottom 0.152: v20.6,17.3 20.68,17.37 22.43,17.37 22.43,17.38 U3.30
GP48  (via drill 0.33)
  Top 0.152: v21.41,16.71 21.68,16.98 U3.32
  Bottom 0.152: U3.32 21.68,16.98 v21.41,16.71
GP49  (via drill 0.33)
  Top 0.152: U3.34 22.22,16.58 21.69,16.05 21.13,16.05 20.55,16.64 19.94,16.64 v19.66,16.92
  Bottom 0.152: v19.66,16.92 19.94,16.64 20.55,16.64 21.13,16.05 21.69,16.05 22.22,16.58 U3.34
GP77_SD_0_CD#  (via drill 0.33)
  Top 0.152: U3.60 22.12,11.38 21.59,10.85 21.29,10.85 v20.95,10.52
  Bottom 0.152: v20.95,10.52 21.29,10.85 21.59,10.85 22.12,11.38 U3.60
GP78_SD_0_CLK  (via drill 0.33)
  Top 0.152: U3.58 22.09,11.78 21.49,11.18 20.17,11.18 v20.14,11.15
  Bottom 0.152: v20.14,11.15 20.17,11.18 21.49,11.18 22.09,11.78 U3.58
GP79_SD_0_CMD  (via drill 0.33)
  Top 0.152: U3.62 22.16,10.98 21.64,10.46 21.64,10.26 21.23,9.86 20.3,9.86 v19.99,10.16
  Bottom 0.152: v19.99,10.16 20.3,9.86 21.23,9.86 21.64,10.26 21.64,10.46 22.16,10.98 U3.62
GP80_SD_0_DAT0  (via drill 0.33)
  Top 0.152: v21.31,8.89 21.31,9.04 22.45,10.18 U3.66
  Bottom 0.152: U3.66 22.45,10.18 21.31,9.04 v21.31,8.89
GP81_SD_0_DAT1  (via drill 0.33)
  Top 0.152: U3.70 22.56,9.38 22.38,9.2 22.38,8.79 22.99,8.18 v23.04,8.18
  Bottom 0.152: v23.04,8.18 22.99,8.18 22.38,8.79 22.38,9.2 22.56,9.38 U3.70
GP82_SD_0_DAT2  (via drill 0.33)
  Top 0.152: U3.64 22.19,10.58 21.95,10.34 21.95,10.11 21.39,9.55 20.7,9.55 v20.34,9.2
  Bottom 0.152: v20.34,9.2 20.7,9.55 21.39,9.55 21.95,10.11 21.95,10.34 22.19,10.58 U3.64
GP83_SD_0_DAT3  (via drill 0.33)
  Top 0.152: v22,8.15 22,9.25 22.53,9.78 U3.68
  Bottom 0.152: U3.68 22.53,9.78 22,9.25 v22,8.15
GP84_SD_CLK_FB  (via drill 0.33)
  Top 0.152: U3.44 22.48,14.58 22.4,14.5 21.89,14.5 21.31,15.09 v21.16,15.09
  Bottom 0.152: v21.16,15.09 21.31,15.09 21.89,14.5 22.4,14.5 22.48,14.58 U3.44 | U3.44
GP109_SPI_2_CLK  (via drill 0.33)
  Top 0.152: U3.55 26.99,12.18 27.33,11.84 28.14,11.84 28.75,12.45 28.98,12.45 29.64,13.11 v29.64,13.44
  Bottom 0.152: v29.64,13.44 29.64,13.11 28.98,12.45 28.75,12.45 28.14,11.84 27.33,11.84 26.99,12.18 U3.55
GP110_SPI_2_FS0  (via drill 0.33)
  Top 0.152: v28.7,13.11 28.7,12.83 28.02,12.14 27.46,12.14 27.02,12.58 U3.53
  Bottom 0.152: U3.53 27.02,12.58 27.46,12.14 28.02,12.14 28.7,12.83 v28.7,13.11
GP111_SPI_2_FS1  (via drill 0.33)
  Top 0.152: v27.74,12.8 27.56,12.98 U3.51
  Bottom 0.152: U3.51 27.56,12.98 v27.74,12.8
GP114_SPI_2_RXD  (via drill 0.33)
  Top 0.152: U3.59 26.92,11.38 27.08,11.23 28.91,11.23 v29.03,11.35
  Bottom 0.152: U3.59 26.92,11.38 27.08,11.23 28.91,11.23 v29.03,11.35
GP115_SPI_2_TXD  (via drill 0.33)
  Top 0.152: U3.57 26.95,11.78 27.2,11.53 28.27,11.53 28.88,12.14 29.62,12.14 v29.64,12.17
  Bottom 0.152: U3.57 26.95,11.78 27.2,11.53 28.27,11.53 28.88,12.14 29.62,12.14 v29.64,12.17
GP128_UART_1_CTS  (via drill 0.33)
  Top 0.152: U3.65 26.9,10.18 27.84,9.25 v27.91,9.25
  Bottom 0.152: v27.91,9.25 27.84,9.25 26.9,10.18 U3.65
GP129_UART_1_RTS  (via drill 0.33)
  Top 0.152: v28.93,10.34 28.5,9.91 27.66,9.91 26.99,10.58 U3.63
  Bottom 0.152: v28.93,10.34 28.5,9.91 27.66,9.91 26.99,10.58 U3.63 25.24,10.58 25.15,10.49 25.15,7.67 24.41,6.93 20.83,6.93 17.14,10.62 SJ3.1
GP130_UART_1_RX  (via drill 0.33, 0.51)
  Top 0.152: v27.94,10.57 27.61,10.9 26.95,10.9 26.87,10.98 U3.61 | v18.92,14.1 18.92,15.37 v17.78,16.51
  Bottom 0.152: v27.94,10.57 27.61,10.9 26.95,10.9 26.87,10.98 U3.61 25.18,10.98 24.82,10.62 24.82,7.85 24.21,7.24 20.98,7.24 18.92,9.3 v18.92,14.1 | v17.78,16.51 16.05,18.24 SJ2.1
GP131_UART_1_TX  (via drill 0.33)
  Top 0.152: U3.46 22.52,14.18 22.5,14.2 21.77,14.2 21.54,14.43 20.85,14.43 20.3,14.99 v20.07,14.99
  Bottom 0.152: U3.46 22.52,14.18 22.5,14.2 21.77,14.2 21.54,14.43 20.85,14.43 20.3,14.99 v20.07,14.99 18.14,14.99 17.58,14.43 SJ1.1
GP134_UART_2_RX  (via drill 0.33)
  Top 0.152: v21.77,18.95 21.8,18.98 U3.22
  Bottom 0.152: v21.77,18.95 21.8,18.98 U3.22 24.06,18.98 24.13,19.05 24.13,23.16 23.98,23.32 18.24,23.32 14.78,19.86 SJ2.3
GP135_UART_2_TX  (via drill 0.33)
  Top 0.152: v29.39,18.54 29.06,18.54 28.73,18.21 28.35,18.21 27.76,17.63 27.23,17.63 27.08,17.78 U3.27
  Bottom 0.152: v29.39,18.54 29.06,18.54 28.73,18.21 28.35,18.21 27.76,17.63 27.23,17.63 27.08,17.78 U3.27 25.15,17.78 24.77,18.16 24.77,23.37 24.38,23.75 16.13,23.75 12.7,20.32 12.7,16.38 13.03,16.05 SJ1.3
GP165  (via drill 0.33)
  Top 0.152: v27.48,18.29 27.38,18.18 U3.25
  Bottom 0.152: v27.48,18.29 27.38,18.18 U3.25 25.25,18.18 25.15,18.29 25.15,23.62 24.64,24.13 15.88,24.13 12.32,20.57 12.32,13.08 13.16,12.24 SJ3.3
GP182_PWM2  (via drill 0.33)
  Top 0.152: U3.37 27.02,15.78 27.1,15.7 27.61,15.7 28.14,16.23 v28.32,16.23
  Bottom 0.152: v28.32,16.23 28.14,16.23 27.61,15.7 27.1,15.7 27.02,15.78 U3.37
GP183_PWM3  (via drill 0.33)
  Top 0.152: v29.39,16.41 29.39,16.36 28.6,15.57 27.91,15.57 27.74,15.39 26.62,15.39 26.61,15.38 U3.39
  Bottom 0.152: U3.39 26.61,15.38 26.62,15.39 27.74,15.39 27.91,15.57 28.6,15.57 29.39,16.36 v29.39,16.41
MISO
  Top 0.254: U4.16 16.99,35.6 17.37,35.97 17.53,36.13 17.78,36.39 17.78,49.53 24.51,56.26 24.51,58.42 24.13,58.8 JP2.10
MOSI
  Top 0.254: U4.15 17.75,33.75 18.48,34.48 18.48,36.26 20.32,38.1 20.32,48.26 26.67,54.61 JP2.11
MSIC_SLP_CLK  (via drill 0.33)
  Top 0.152: v27.51,21.46 27.19,21.78 U3.7
  Bottom 0.152: U3.7 27.19,21.78 v27.51,21.46
N$1
  Top 0.254: 16.44,25.15 16.44,25.47 15.5,26.41 U4.8
N$2
  Top 0.254: U4.7 14.7,26.38 14.04,25.72 14.04,25.15
N$4
  Top 0.254: LED1.C 1.66,7.59 R11.2
N$7
  Top 0.254: D3.A 1.66,11.4 R6.2
OSC_CLK_OUT  (via drill 0.33)
  Top 0.152: v27.51,8.33 27.23,8.61 27.23,9.37 26.82,9.78 U3.67
  Bottom 0.152: U3.67 26.82,9.78 27.23,9.37 27.23,8.61 v27.51,8.33
PSW  (via drill 0.33)
  Top 0.152: v29.21,19.53 29.18,19.56 28.17,19.56 27.86,19.25 27.05,19.25 26.78,18.98 U3.21
  Bottom 0.152: U3.21 26.78,18.98 27.05,19.25 27.86,19.25 28.17,19.56 29.18,19.56 v29.21,19.53
PWRBTN#  (via drill 0.33)
  Top 0.152: v28.19,20.52 27.53,19.86 26.8,19.86 26.71,19.78 U3.17
  Bottom 0.152: U3.17 26.71,19.78 26.8,19.86 27.53,19.86 v28.19,20.52
RCVR_MODE  (via drill 0.33)
  Top 0.152: v28.65,17.55 28.12,17.55 27.89,17.32 26.92,17.32 26.58,16.98 U3.31
  Bottom 0.152: U3.31 26.58,16.98 26.92,17.32 27.89,17.32 28.12,17.55 v28.65,17.55
RESET
  Top 0.254: U4.29 5.74,31.35 C2.1 R2.1 | 4.45,31.27 R2.1 | S1.P$2 3.01,39.98 3.05,39.94 | R2.1 3.05,32.73 3.05,39.94 | JP2.3 JP3.3 6.35,40.51 5.78,39.94 3.05,39.94
RESET_OUT#  (via drill 0.33)
  Top 0.152: U3.36 22.25,16.18 21.82,15.75 20.5,15.75 v20.27,15.98
  Bottom 0.152: v20.27,15.98 20.5,15.75 21.82,15.75 22.25,16.18 U3.36
SCK  (via drill 0.51)
  Top 0.254: JP2.9 11.43,50.8 11.43,48.39 12.45,47.37 14.22,47.37 15.24,46.35 15.24,37.85 15.5,37.59 U4.17 15.5,34.65 v15.55,34.6 | v3.62,21.59 3.62,11.66 R6.1
  Bottom 0.254: v15.55,34.6 12.88,31.93 12.88,28.22 6.25,21.59 v3.62,21.59
USB_DN  (via drill 0.33)
  Top 0.152: U3.18 22.64,19.78 22.5,19.91 20.88,19.91 20.24,20.55 v20.24,21.01
  Bottom 0.152: v20.24,21.01 20.24,20.55 20.88,19.91 22.5,19.91 22.64,19.78 U3.18
USB_DP  (via drill 0.33)
  Top 0.152: v21.16,20.57 22.3,20.57 22.7,20.18 U3.16
  Bottom 0.152: U3.16 22.7,20.18 22.3,20.57 v21.16,20.57
USB_ID  (via drill 0.33)
  Top 0.152: v27.51,22.86 27.23,22.58 U3.3
  Bottom 0.152: U3.3 27.23,22.58 v27.51,22.86
USB_VBUS  (via drill 0.33)
  Top 0.152: v19.86,19.99 20.24,19.61 22.28,19.61 22.5,19.38 U3.20
  Bottom 0.152: U3.20 22.5,19.38 22.28,19.61 20.24,19.61 v19.86,19.99
V_BAT_BKUP  (via drill 0.33)
  Top 0.152: v28.45,18.87 28.37,18.95 27.18,18.95 26.81,18.58 U3.23
  Bottom 0.152: U3.23 26.81,18.58 27.18,18.95 28.37,18.95 v28.45,18.87
VCC  (via drill 0.51)
  Top 0.356: U4.18 14.7,34.29 | 14.7,34.29 14.7,29.69 14.22,29.21 13.97,29.21 | 13.97,29.21 12.83,29.21 12.3,28.68 U4.4 12.3,25.42 C3.2 v12.28,24.13 | U4.6 13.9,29.14 13.97,29.21 | U1.5 10.48,5.4 10.03,4.95 C13.A 7.75,4.95 7.2,5.5 C10.1 5.68,5.5 4.89,6.29 4.89,6.35 | R2.2 4.45,25.4 4.89,24.96 v4.89,19.05 4.89,10.79 | LED1.A 4.89,6.35 | U5.14 8.63,12.19 8.04,11.6 C4.2 4.89,10.79 | v12.7,34.29 14.7,34.29 | 4.89,10.79 4.89,6.35
  Bottom 0.356: v12.28,24.13 7.2,19.05 v4.89,19.05 3.62,20.32 JP1.4 | v12.7,34.29 12.7,38.1 15.24,40.64 15.24,57.15 13.97,58.42 10.16,58.42 8.89,59.69 JP2.4
VIN  (via drill 0.51)
  Top 0.254: 15.37,6.35 14.42,7.3 U1.3 | 15.37,6.35 v16.51,6.35 C19.A | 15.37,6.35 14.42,5.4 U1.1
  Bottom 0.254: SJ4.2 v16.51,6.35
  Bottom 0.356: v16.51,6.35 C19.A 15.37,3.81 5.08,3.81 0.51,8.38 0.51,43.31 1.27,44.07 1.52,44.07 2.54,45.09 2.54,47.5 1.27,48.77 JP2.1
VSYS  (via drill 0.33, 0.51)
  Top 0.2: U3.4 U3.2 U3.4 | U3.4 U3.6 | U3.4 v22.08,22.58
  Top 0.254: v22.08,22.58 19.56,22.58 16.87,19.89 v16.87,9.8
  Bottom 0.2: U3.4 U3.6 | U3.4 U3.2 | v22.08,22.58 U3.4
  Bottom 0.254: SJ4.1 12.19,7.11 12.7,7.62 14.68,7.62 v16.87,9.8

### Text on the board
Top: v01
tPlace: VIN | GND | RST | 3V3 | A3 | A2 | A1 | A0 | 13 | 12 | 11 | 10 | A5 | A4 | A7 | A6 | TX | RX | RST | GND | 2 | 3 | 4 | 5 | 6 | 7 | 8 | 9 | Arduino | Reset | DTR | TX | RX | VCC | GND | GND | BLK | D13 | PWR
bPlace: VIN | GND | RST | 3V3 | A3 | A2 | A1 | A0 | 13 | 12 | 11 | 10 | A5 | A4 | A7 | A6 | TX | RX | RST | GND | 2 | 3 | 4 | 5 | 6 | 7 | 8 | 9 | Arduino | UART2 | RX | UART1 | UART2 | TX | UART1 | GP165 | DTR | RTS1 | Cut this jumper / if you supply / VIN externally! | 4xM2.0
tDocu: Jim Lindblom